# EAGLE schematic EE445L_Baseline_Schematic (EAGLE 9.6.2)
Fall 2021 EE445L This is the baseline schematic
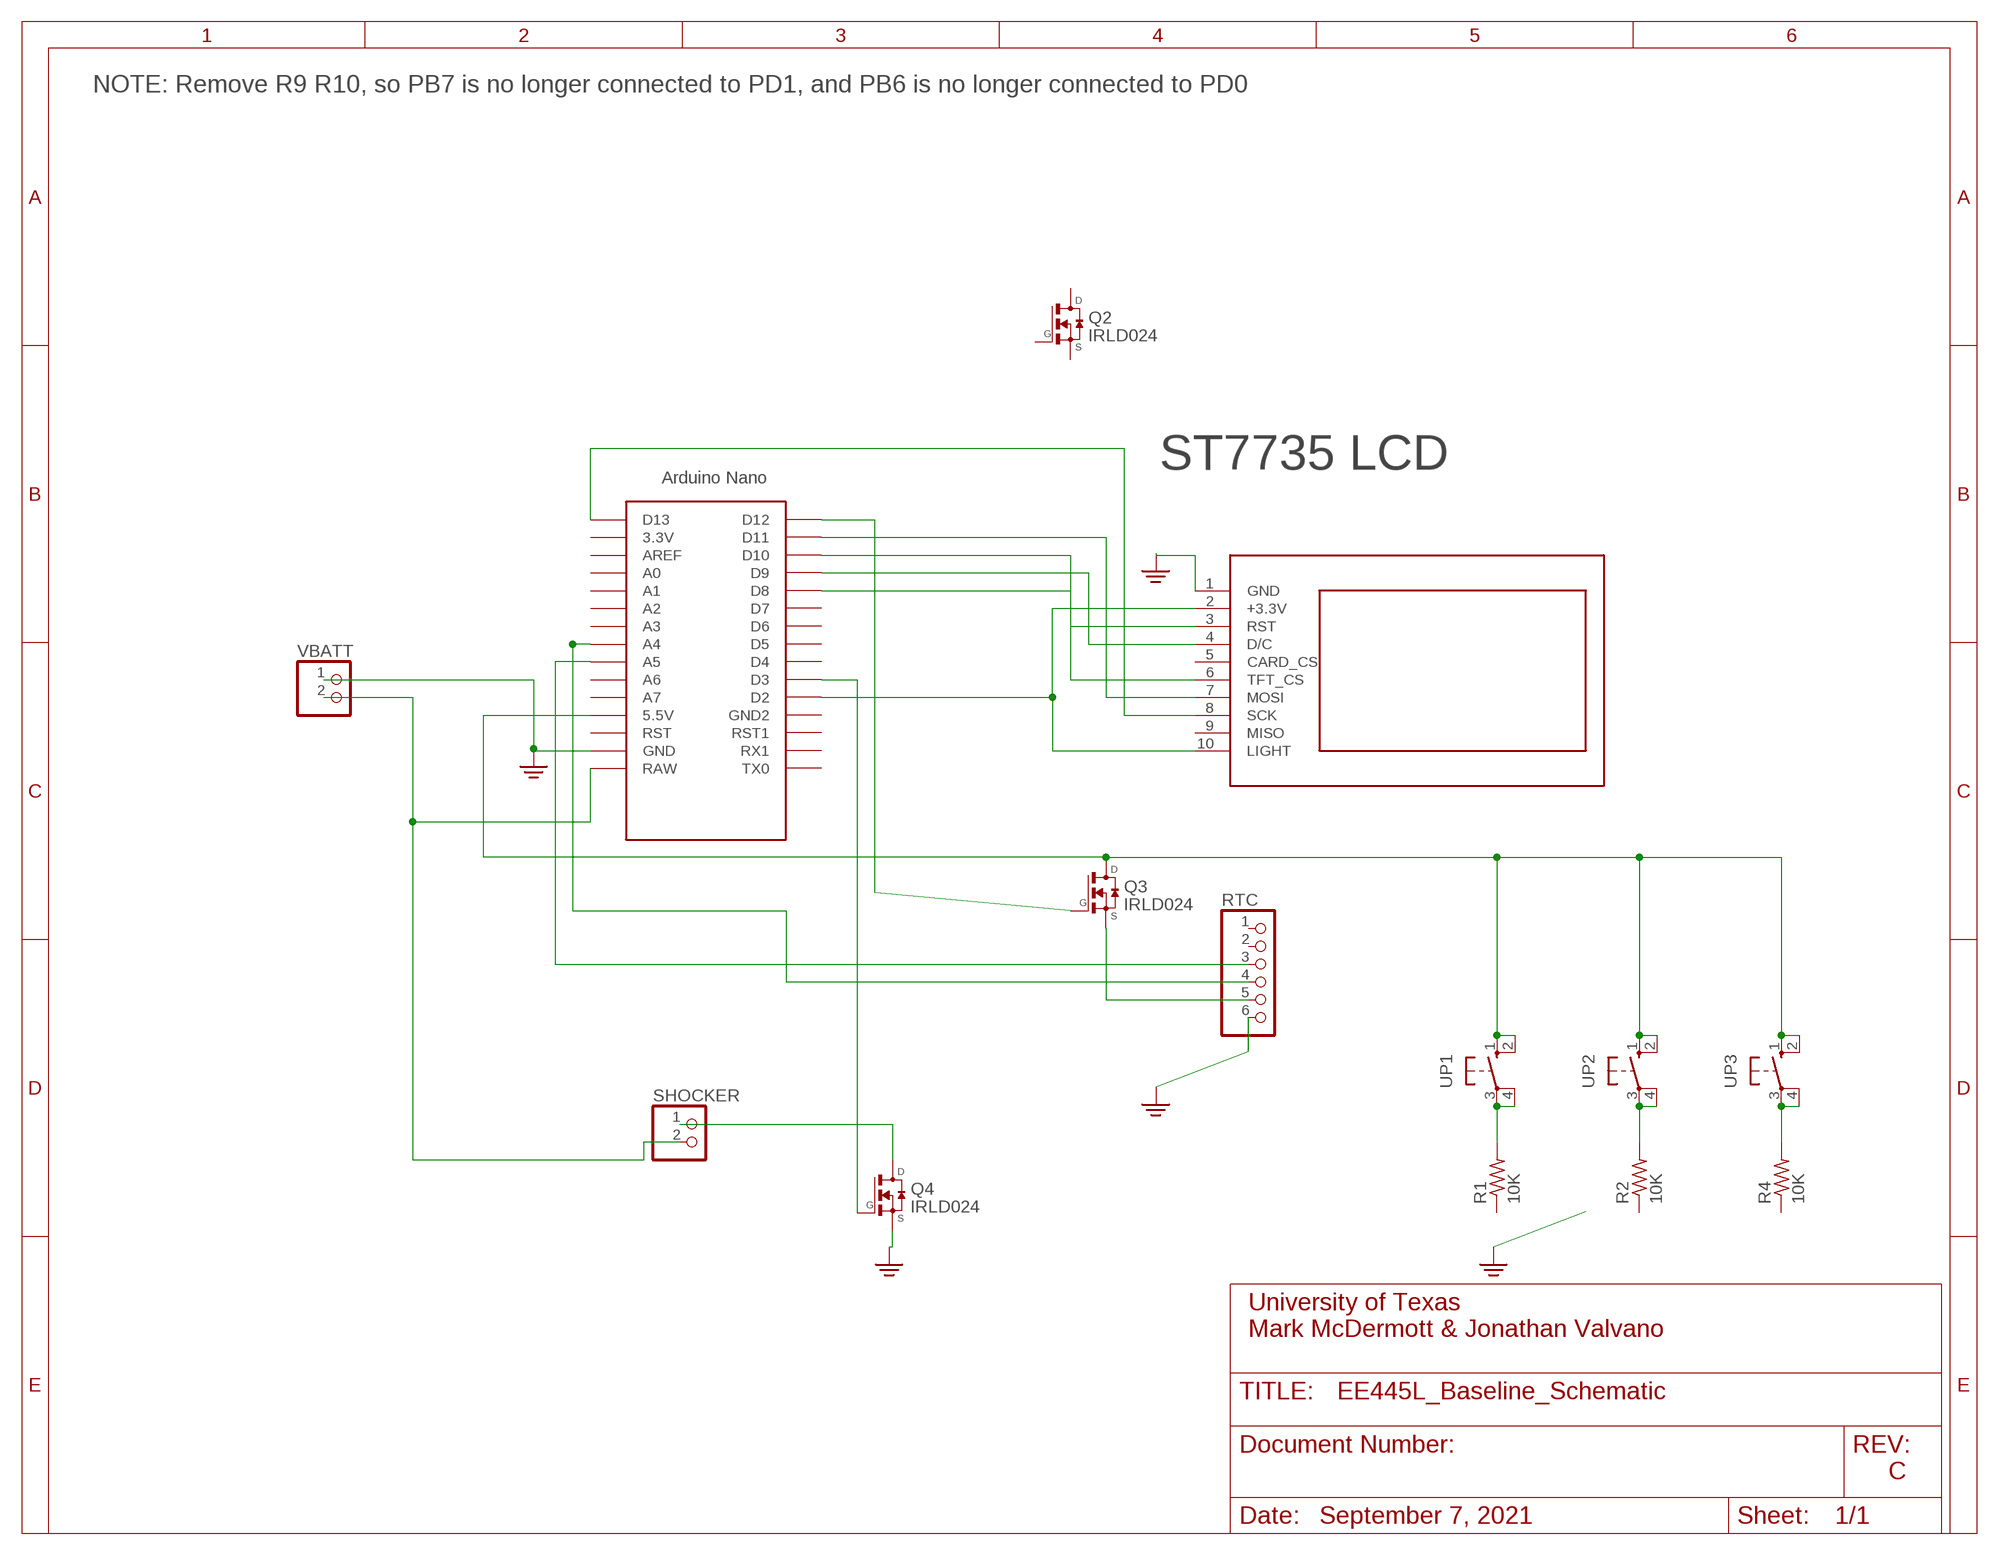
[diagram p0: schematic, sheet 1, part 1 of 2]
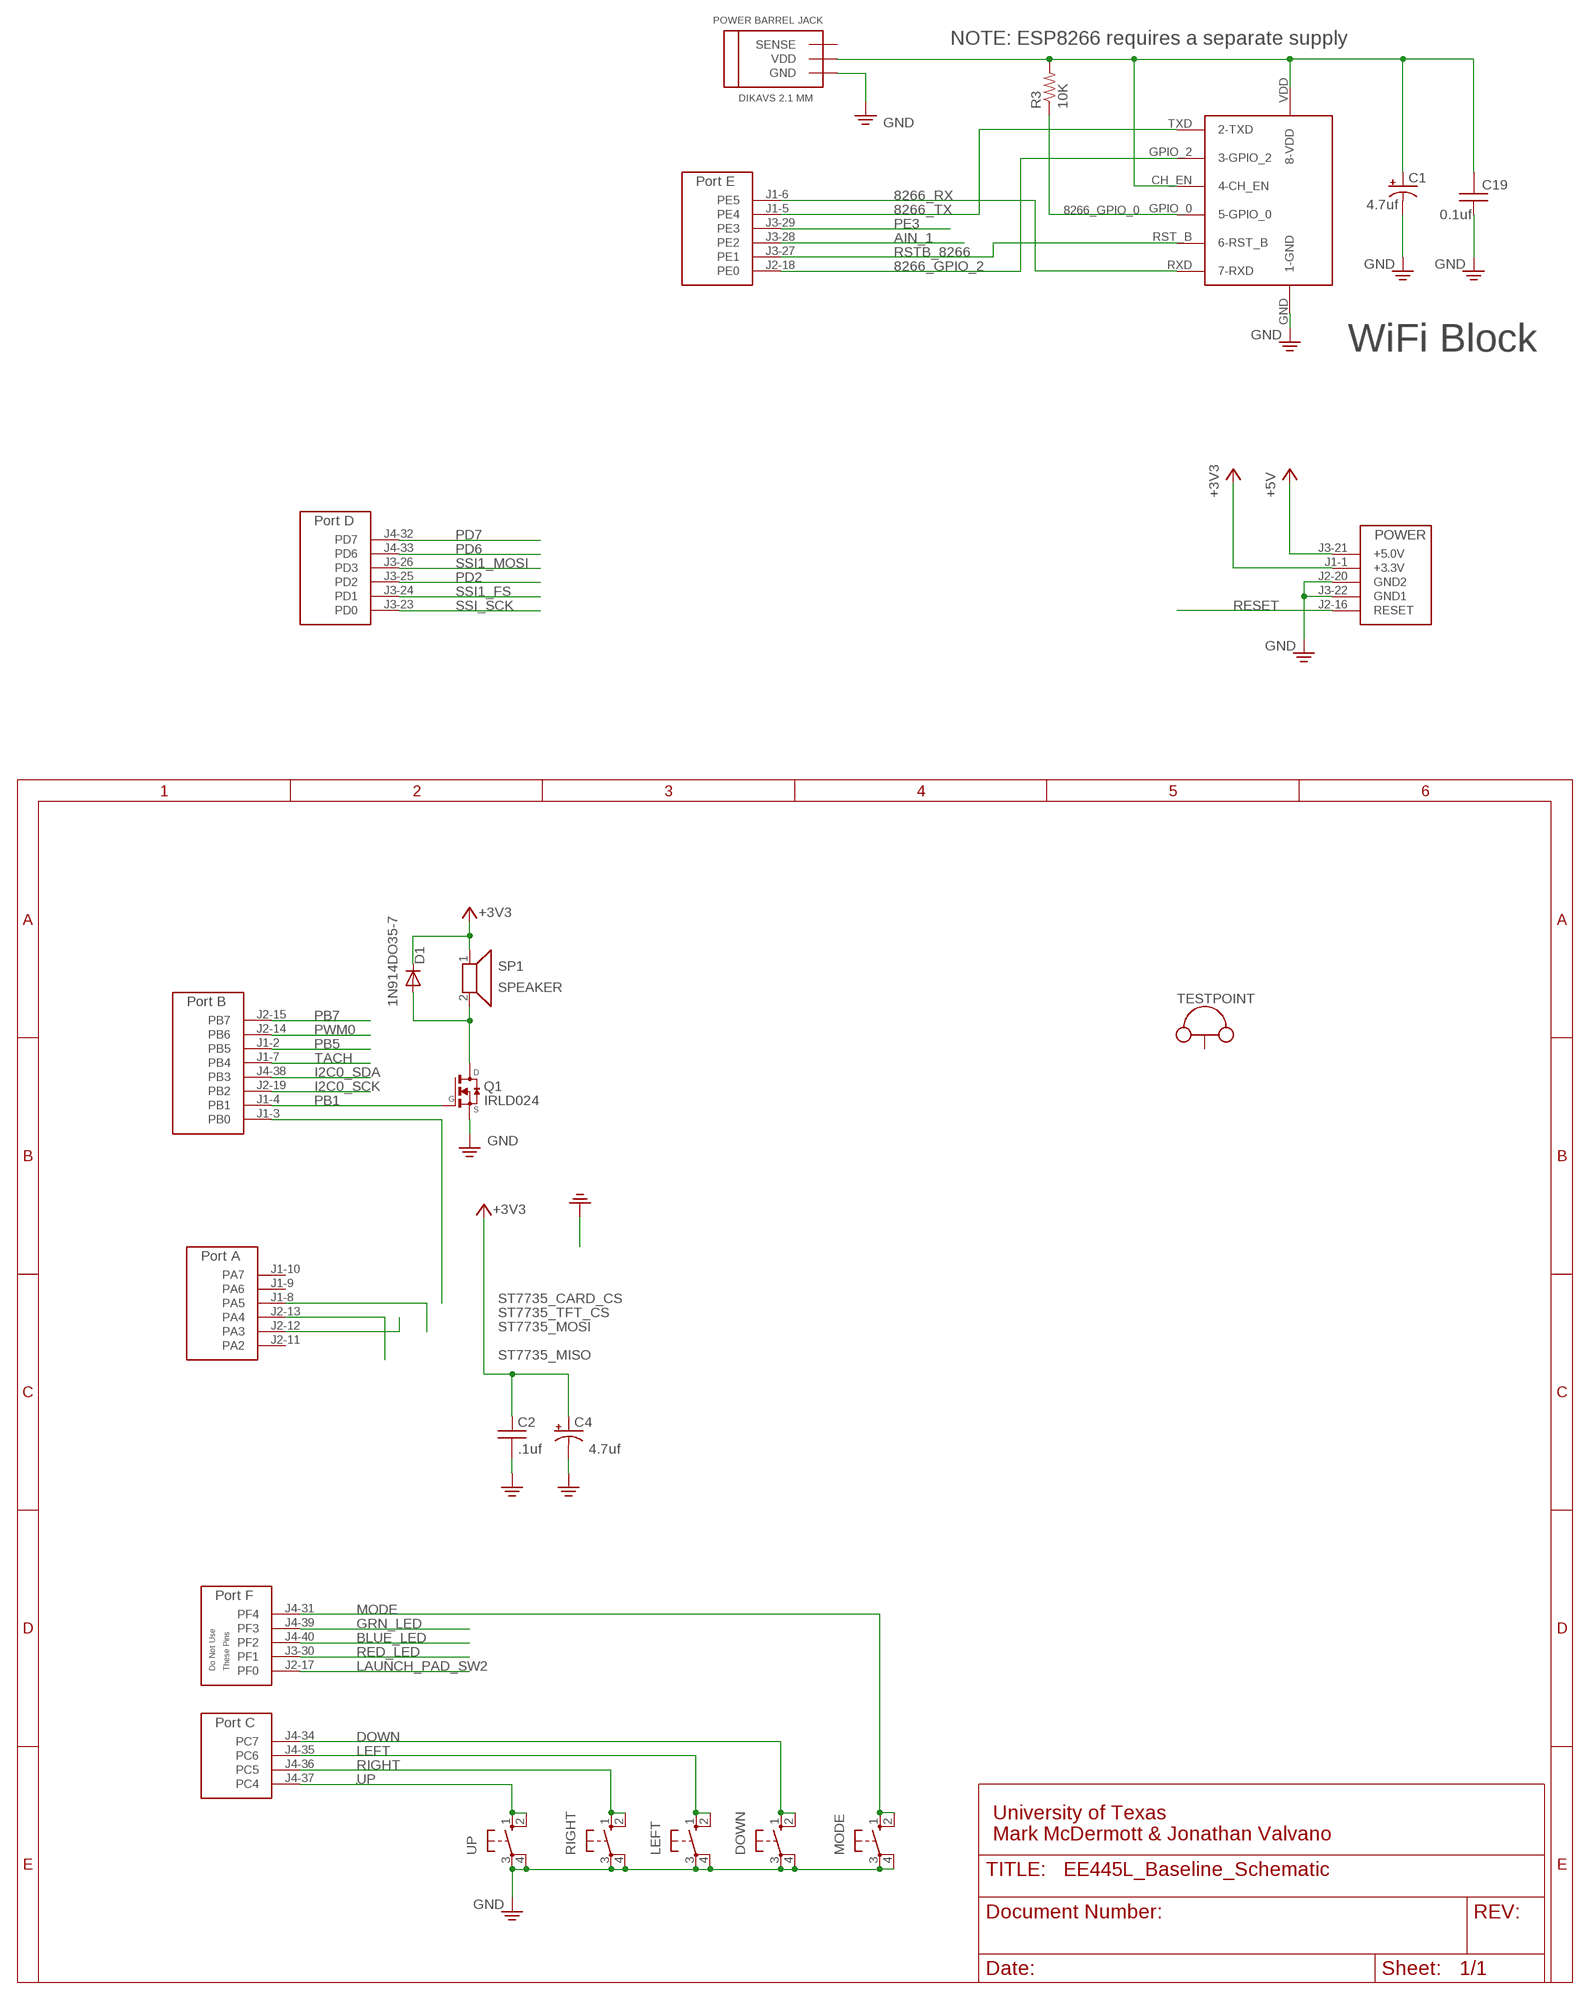
[diagram p1: schematic, sheet 1, part 2 of 2]

## Parts
C1  4.7uf  CAPACITOR_POLARIZEDE5-6  [CAP200MILPOLARIZED]
C2  .1uf  CAPACITOR050-024X044  [CAP200MIL]
C4  4.7uf  CAPACITOR_POLARIZEDE5-6  [CAP200MILPOLARIZED]
C19  0.1uf  CAPACITOR050-024X044  [CAP200MIL]
D1  1N914DO35-7  [DO35-7]
DOWN  B3F-1052  [B3F-10XX]
LEFT  B3F-1052  [B3F-10XX]
MODE  B3F-1052  [B3F-10XX]
Q1  IRLD024  [IRLD024]
Q2  IRLD024  [IRLD024]
Q3  IRLD024  [IRLD024]
Q4  IRLD024  [IRLD024]
R1  10K  RESISTOR0204/7  [RES300MIL]
R2  10K  RESISTOR0204/7  [RES300MIL]
R3  10K  RESISTOR0204/7  [RES300MIL]
R4  10K  RESISTOR0204/7  [RES300MIL]
RIGHT  B3F-1052  [B3F-10XX]
RTC  PINHD-1X6  [1X06]
SHOCKER  PINHD-1X2  [1X02]
SP1  SPEAKER  [1X02]
TESTPOINT  TP_LOOP  [TP_LOOP]
U$1  ESP_8266  [ESP8266]
U$2  TM4C_BP  [TM4C_BOOSTER_PACK]
U$3  ST7735  [ST7735]
U$4  2.1MM_BARREL_JACK  [2.1M_BARREL_JACK]
U$5  NANO  [NANO]
UP  B3F-1052  [B3F-10XX]
UP1  B3F-1052  [B3F-10XX]
UP2  B3F-1052  [B3F-10XX]
UP3  B3F-1052  [B3F-10XX]
VBATT  PINHD-1X2  [1X02]

## Nets
8266_GPIO_0: R3.1 U$1.GPIO_0(5-GPIO_0)
8266_GPIO_2: U$1.GPIO_2(3-GPIO_2) U$2.J2-18(PE0)
8266_RX: U$1.RXD(7-RXD) U$2.J1-6(PE5)
8266_TX: U$1.TXD(2-TXD) U$2.J1-5(PE4)
+3V3: C2.1 C4.+ D1.C SP1.1 U$2.J1-1(+3.3V)
+5V: U$2.J3-21(+5.0V)
AIN_1: U$2.J3-28(PE2)
BLUE_LED: U$2.J4-40(PF2)
DOWN: DOWN.1(S) DOWN.2(S1) U$2.J4-34(PC7)
GND: C1.- C2.2 C4.- C19.1 DOWN.3(P) DOWN.4(P1) LEFT.3(P) LEFT.4(P1) MODE.3(P) MODE.4(P1) Q1.P$4(S) Q4.P$4(S) RIGHT.3(P) RIGHT.4(P1) RTC.6 U$1.GND(1-GND) U$2.J2-20(GND2) U$2.J3-22(GND1) U$3.1(GND) U$4.GND U$5.GND UP.3(P) UP.4(P1) VBATT.1
GND1: R1.2 UP1.3(P) UP1.4(P1)
GND2: R2.2 UP2.3(P) UP2.4(P1)
GND3: R4.2 UP3.3(P) UP3.4(P1)
GRN_LED: U$2.J4-39(PF3)
I2C0_SCK: U$2.J2-19(PB2)
I2C0_SDA: U$2.J4-38(PB3)
LAUNCH_PAD_SW2: U$2.J2-17(PF0)
LEFT: LEFT.1(S) LEFT.2(S1) U$2.J4-35(PC6)
MODE: MODE.1(S) MODE.2(S1) U$2.J4-31(PF4)
N$1: D1.A Q1.P$1(D) SP1.2
N$2: C1.+ C19.2 R3.2 U$1.CH_EN(4-CH_EN) U$1.VDD(8-VDD) U$4.VDD
N$3: SHOCKER.2 U$5.RAW VBATT.2
N$4: U$3.8(SCK) U$5.D13
N$5: U$3.7(MOSI) U$5.D11
N$6: U$3.4(D/C) U$5.D9
N$7: U$3.3(RST) U$5.D8
N$8: U$3.6(TFT_CS) U$5.D10
N$9: U$3.2(+3.3V) U$3.10(LIGHT) U$5.D2
N$10: RTC.4 U$5.A4
N$11: RTC.3 U$5.A5
N$12: Q3.P$3(G) U$5.D12
N$14: Q3.P$4(S) RTC.5
N$15: Q4.P$3(G) U$5.D3
N$16: Q4.P$1(D) SHOCKER.1
PB1: Q1.P$3(G) U$2.J1-4(PB1)
PB5: U$2.J1-2(PB5)
PB7: U$2.J2-15(PB7)
PD2: U$2.J3-25(PD2)
PD6: U$2.J4-33(PD6)
PD7: U$2.J4-32(PD7)
PE3: U$2.J3-29(PE3)
PWM0: U$2.J2-14(PB6)
RED_LED: U$2.J3-30(PF1)
RESET: U$2.J2-16(RESET)
RIGHT: RIGHT.1(S) RIGHT.2(S1) U$2.J4-36(PC5)
RSTB_8266: U$1.RST_B(6-RST_B) U$2.J3-27(PE1)
SSI1_FS: U$2.J3-24(PD1)
SSI1_MOSI: U$2.J3-26(PD3)
SSI_SCK: U$2.J3-23(PD0)
ST7735_CARD_CS: U$2.J1-3(PB0)
ST7735_MISO: U$2.J2-13(PA4)
ST7735_MOSI: U$2.J1-8(PA5)
ST7735_TFT_CS: U$2.J2-12(PA3)
TACH: U$2.J1-7(PB4)
UP: U$2.J4-37(PC4) UP.1(S) UP.2(S1)
UP1: Q3.P$1(D) U$5.5V(5.5V) UP1.1(S) UP1.2(S1) UP2.1(S) UP2.2(S1) UP3.1(S) UP3.2(S1)
Unconnected: Q2.P$1(D) Q2.P$3(G) Q2.P$4(S) R1.1 R2.1 R4.1 RTC.1 RTC.2 TESTPOINT.P$1(TP) TESTPOINT.P$2(TP) U$2.J1-9(PA6) U$2.J1-10(PA7) U$2.J2-11(PA2) U$3.5(CARD_CS) U$3.9(MISO) U$4.SENSE U$5.3.3V U$5.A0 U$5.A1 U$5.A2 U$5.A3 U$5.A6 U$5.A7 U$5.AREF U$5.D4 U$5.D5 U$5.D6 U$5.D7 U$5.GND1(GND2) U$5.ICSP1 U$5.ICSP2 U$5.ICSP3 U$5.ICSP4 U$5.ICSP5 U$5.ICSP6 U$5.RST U$5.RST1 U$5.RX1 U$5.TX0

## Notes on the sheet
- NOTE: ESP8266 requires a separate supply
- WiFi Block
- NOTE: Remove R9 R10, so PB7 is no longer connected to PD1, and PB6 is no longer connected to PD0
- ST7735 LCD
- University of Texas
  Mark McDermott & Jonathan Valvano
- University of Texas
  Mark McDermott & Jonathan Valvano
- C
- September 7, 2021

## Library data of the parts
C1 C4 = EE445L:CAPACITOR_POLARIZED: POLARIZED CAPACITOR, American symbol
C2 C19 = EE445L:CAPACITOR: CAPACITOR, American symbol
D1 = EE445L:1N914: DIODE high speed (Philips) 1N914
DOWN LEFT MODE RIGHT UP UP1-UP3 = EE445L:B3F-1052: OMRON SWITCH 1.1mm holes; MPN: B3F-1000; OC_FARNELL: 176432; OC_NEWARK: 36M3542
Q1-Q4 = EE445L:IRLD024: N-Channel Enhancement MOSFET
R1-R4 = EE445L:RESISTOR: RESISTOR, American symbol
RTC = EE445L:PINHD-1X6: PIN HEADER
SHOCKER VBATT = EE445L:PINHD-1X2: PIN HEADER
SP1 = EE445L:SPEAKER: Speaker Connected off PCB with two wires. 32-ohm speaker, AllElectronics, SK-230, http://www.allelectronics.com/make-a-store/item/sk-230/20-mm-32-ohm-speaker/1.html
TESTPOINT = EE445L:TP_LOOP
U$1 = EE445L:ESP_8266
U$2 = EE445L:TM4C_BP
U$3 = EE445L:ST7735
U$4 = EE445L:2.1MM_BARREL_JACK
U$5 = Arduino-clone:NANO: Arduino Nano